# EAGLE design Antenna Analyzer R1 (EAGLE 6.4)
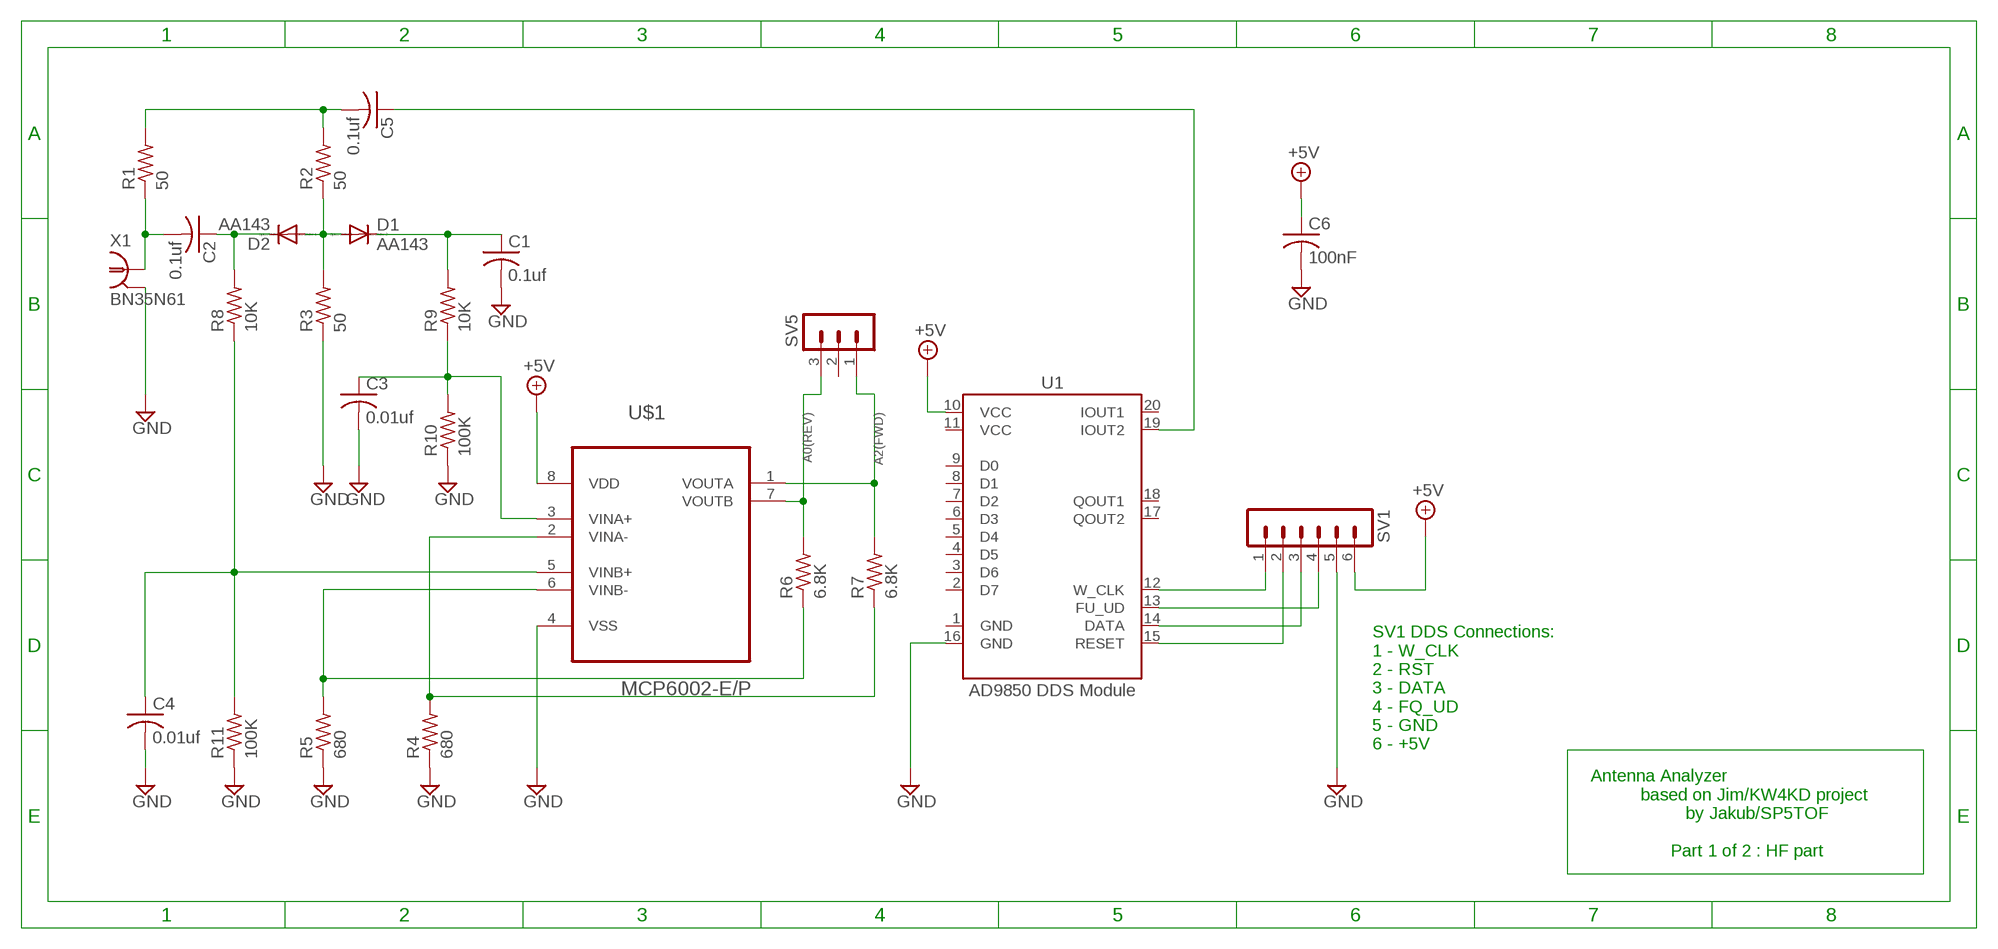
[diagram p0: schematic, sheet 1]

## Parts
C1  0.1uf  C-US050-025X075  [C050-025X075]
C2  0.1uf  C-US050-025X075  [C050-025X075]
C3  0.01uf  C-US050-025X075  [C050-025X075]
C4  0.01uf  C-US050-025X075  [C050-025X075]
C5  0.1uf  C-US050-025X075  [C050-025X075]
C6  100nF  C-US050-025X075  [C050-025X075]
D1  AA143  AA119  [DO07]
D2  AA143  AA119  [DO07]
R1  50  R-US_0309/12  [0309/12]
R2  50  R-US_0309/12  [0309/12]
R3  50  R-US_0309/12  [0309/12]
R4  680  R-US_0309/12  [0309/12]
R5  680  R-US_0309/12  [0309/12]
R6  6.8K  R-US_0309/12  [0309/12]
R7  6.8K  R-US_0309/12  [0309/12]
R8  10K  R-US_0309/12  [0309/12]
R9  10K  R-US_0309/12  [0309/12]
R10  100K  R-US_0309/12  [0309/12]
R11  100K  R-US_0309/12  [0309/12]
SV1  MA06-1  [MA06-1]
SV5  MA03-1  [MA03-1]
U1  AD9850 DDS Module  DDS_MODULE:AD9850DDS_MODULE  [DDS_AD9850]
U$1  MCP6002-E/P  [DIP254P762X533-8]
X1  BN35N61  [B35N61]

## Nets
+5V: C6.1 SV1.6 U1.10(VCC) U$1.8(VDD)
A0(REV): R6.2 SV5.3 U$1.7(VOUTB)
A2(FWD): R7.2 SV5.1 U$1.1(VOUTA)
GND: C1.2 C3.2 C4.2 C6.2 R3.1 R4.1 R5.1 R10.1 R11.1 SV1.5 U1.16(GND) U$1.4(VSS) X1.2 X1.3 X1.4 X1.5
N$1: D1.A D2.A R2.1 R3.2
N$2: C2.2 R1.1 X1.1
N$3: C2.1 D2.C R8.2
N$4: C1.1 D1.C R9.2
N$5: C3.1 R9.1 R10.2 U$1.3(VINA+)
N$6: C5.2 R1.2 R2.2
N$7: SV1.1 U1.12(W_CLK)
N$8: SV1.2 U1.15(RESET)
N$9: R5.2 R6.1 U$1.6(VINB-)
N$10: C4.1 R8.1 R11.2 U$1.5(VINB+)
N$11: R4.2 R7.1 U$1.2(VINA-)
N$12: C5.1 U1.19(IOUT2)
N$13: SV1.3 U1.14(DATA)
N$14: SV1.4 U1.13(FU_UD)
Unconnected: SV5.2 U1.2(D7) U1.3(D6) U1.4(D5) U1.5(D4) U1.6(D3) U1.7(D2) U1.8(D1) U1.9(D0) U1.17(QOUT2) U1.18(QOUT1) U1.20(IOUT1)

## Notes on the sheet
- SV1 DDS Connections:
  1 - W_CLK
  2 - RST
  3 - DATA
  4 - FQ_UD
  5 - GND
  6 - +5V
- Antenna Analyzer
             based on Jim/KW4KD project
                      by Jakub/SP5TOF
                  
                   Part 1 of 2 : HF part

## Power pins joined to a net without a drawn wire
GND: U1.1(GND)
VCC: U1.11(VCC)

## Library data of the parts
C1-C6 = rcl:C-US: CAPACITOR, American symbol
D1 D2 = diode:AA119: DIODE germanium
R1-R11 = rcl:R-US_: RESISTOR, American symbol
SV1 = con-lstb:MA06-1: PIN HEADER; OC_FARNELL: unknown; OC_NEWARK: unknown
SV5 = con-lstb:MA03-1: PIN HEADER; OC_FARNELL: unknown; OC_NEWARK: unknown
U1 = dds-module-ad9850:DDS_MODULE:AD9850: AD9850 DDS Module Created by Johan Adler, October 2014. Not tested on an actual PCB, so I can't promise anything. Also please check the actual pinout of your specific module. Mine are of the low price eBay version, and the pinout is correct for my modules. The placement of VCC over data pins over GND on the symbol is meant to make it easier to set it up for default serial transfer. For this you would connect D0 and D1 to VCC, D2 to GND. IOUT is analog signal out, sinus wave, QOUT is square wave. Outputs 1 are normal, outputs 2 are inverted.
U$1 = Microchip_By_element14_Batch_1:MCP6002-E/P: Low-Power Op Amp; MPN: MCP6002-E/P; OC_FARNELL: 1332117; OC_NEWARK: 34M7472; PACKAGE: DIP-8; SUPPLIER: Microchip
X1 = con-coax:BN35N61: BNC CONNECTOR M/A COM www.macom.com distributor Farnell 149-452; OC_FARNELL: unknown; OC_NEWARK: unknown

## Board
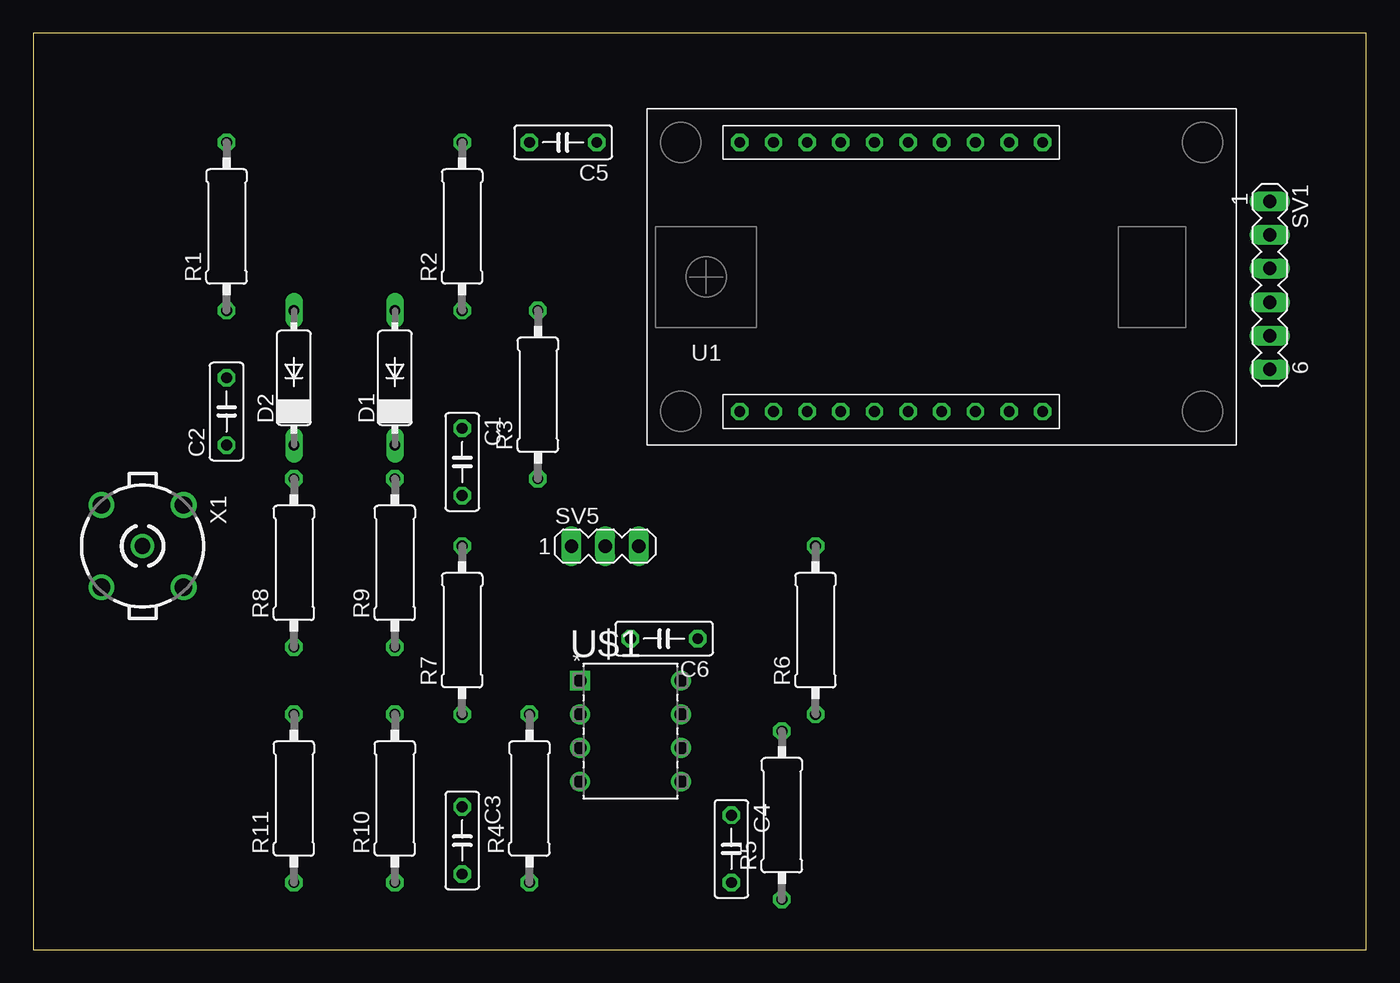
[diagram p1: board, top side]
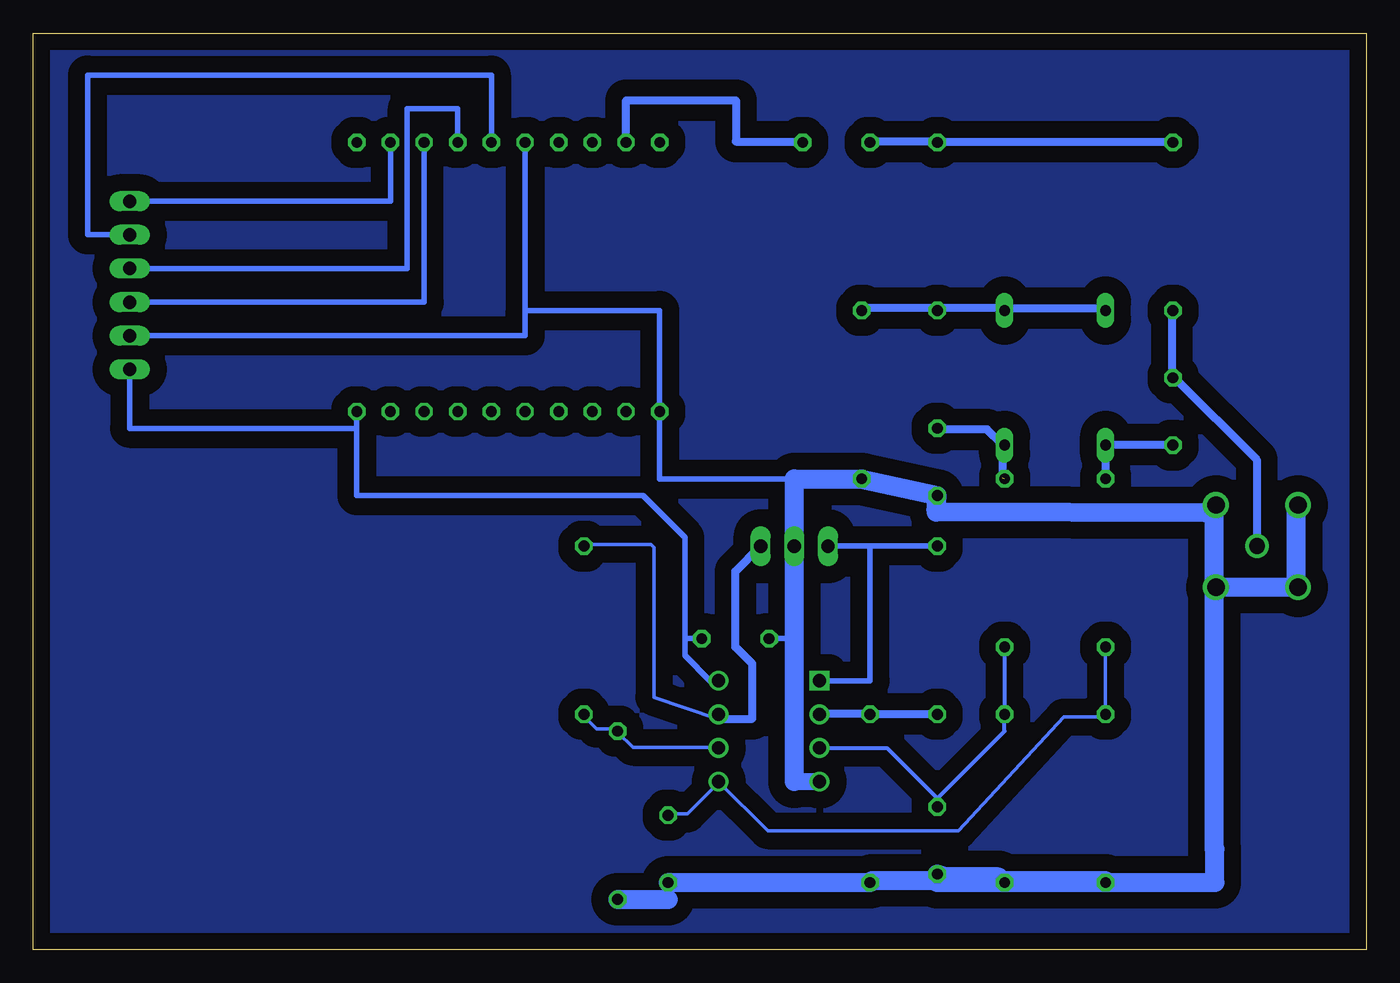
[diagram p2: board, bottom side, seen from below]

Size 100.63 x 69.2 mm. Coordinates in mm from the lower left corner, seen from the top.
Outline: 0,0 100.63,0 100.63,69.2 0,69.2 0,0
Copper layers (1*16): Top 0.035mm / dielectric 1.5mm / Bottom 0.035mm
Design rules "default": minimum track width 10mil, minimum drill 24mil, track to track 8mil, track to pad 8mil, pad to pad 8mil, via to via 8mil, smd to smd 8mil, copper to edge 40mil, drill to drill 8mil, minimum pad ring 10mil, minimum via ring 8mil, stop-mask expansion 4mil, vias tented up to drill 0mil, thermal gap 10mil

### Footprints (pad centres in the part's own frame; a part is rotated, then mirrored left to right if it is on the bottom)
C050-025X075 = drill 0.813 octagon: 1 -2.54,0; 2 2.54,0
DO07 = drill 0.813 long: A 5.08,0; C -5.08,0
0309/12 = drill 0.813 octagon: 1 -6.35,0; 2 6.35,0
MA06-1 = drill 1.016 long: 1 -6.35,0; 2 -3.81,0; 3 -1.27,0; 4 1.27,0; 5 3.81,0; 6 6.35,0
MA03-1 = drill 1.016 long: 1 -2.54,0; 2 0,0; 3 2.54,0
DDS_AD9850 = drill 0.8 octagon: 1 -15.24,-10.16; 2 -12.7,-10.16; 3 -10.16,-10.16; 4 -7.62,-10.16; 5 -5.08,-10.16; 6 -2.54,-10.16; 7 0,-10.16; 8 2.54,-10.16; 9 5.08,-10.16; 10 7.62,-10.16; 11 7.62,10.16; 12 5.08,10.16; 13 2.54,10.16; 14 0,10.16; 15 -2.54,10.16; 16 -5.08,10.16; 17 -7.62,10.16; 18 -10.16,10.16; 19 -12.7,10.16; 20 -15.24,10.16
DIP254P762X533-8 = drill 0.991 square: 1 -7.62,7.62 | drill 0.991: 2 -7.62,5.08; 3 -7.62,2.54; 4 -7.62,0; 5 0,0; 6 0,2.54; 7 0,5.08; 8 0,7.62
B35N61 = drill 1.2: 1 0,0 | drill 1.3: 2 3.099,3.099; 3 -3.099,3.099; 4 -3.099,-3.099; 5 3.099,-3.099

### Placement (x,y rotation side)
C1  32.39,36.83 270 top
C2  14.61,40.64 90 top
C3  32.39,8.26 270 top
C4  52.71,7.62 270 top
C5  40.01,60.96 180 top
C6  47.62,23.5 180 top
D1  27.3,43.18 90 top
D2  19.68,43.18 90 top
R1  14.61,54.61 90 top
R2  32.39,54.61 90 top
R3  38.1,41.91 90 top
R4  37.47,11.43 90 top
R5  56.52,10.16 90 top
R6  59.05,24.13 90 top
R7  32.39,24.13 90 top
R8  19.68,29.21 90 top
R9  27.3,29.21 90 top
R10  27.3,11.43 90 top
R11  19.68,11.43 90 top
SV1  93.34,50.17 270 top
SV5  43.18,30.48 0 top
U1  68.58,50.8 0 top
U$1  48.9,12.7 0 top
X1  8.26,30.48 270 top

### Tracks (layer width: path | path; a pad name or v marks a point on that pad's centre or on a via)
+5V
  Bottom 0.406: SV1.6 93.34,39.37 76.2,39.37 | 76.2,39.37 U1.10 | 76.2,39.37 76.2,34.29 54.61,34.29 51.44,31.12 51.44,23.5 | U$1.8 49.53,20.32 51.44,22.23 51.44,23.5 | C6.1 51.44,23.5
A0(REV)
  Bottom 0.254: R6.2 59.03,30.61 54,30.61 53.77,30.38 53.77,19.08 48.97,17.45
  Bottom 0.406: 48.97,17.8 U$1.7
  Bottom 0.61: 48.97,17.8 48.97,17.45 46.36,17.45 46.36,21.59 47.62,22.86 47.62,28.58 SV5.3
A2(FWD)
  Bottom 0.406: U$1.1 37.47,20.32 37.47,30.48 | 37.47,30.48 SV5.1 | R7.2 37.47,30.48
GND
  Bottom 0.254: 11.25,27.41 X1.2 11.48,27.41 11.48,27.94 | 5.31,33.58 X1.4 | 5.31,27.41 X1.5 | 12.17,33 11.48,33.58 X1.3 | R4.1 37.31,5.23 33.43,5.23 32.51,6.15 C3.2 | 19.71,5.23 R11.1 | 27.25,5.23 R10.1 27.48,5.23
  Bottom 0.406: 52.71,3.81 C4.2 | 32.39,5.23 32.39,5.08 | 11.43,7.62 11.48,7.62 | C6.2 43.18,23.5 | U1.16 63.5,48.26 | 63.5,48.26 53.34,48.26 U1.1 53.34,35.56 43.18,35.56 | SV1.5 63.5,46.36 63.5,48.26
  Bottom 1.27: U$1.4 43.18,12.7
  Bottom 1.422: 11.25,27.41 5.31,27.41 5.31,33.58 | 11.48,33.58 11.48,27.94 11.48,7.62 | 12.17,33 32.49,33.05 C1.2 R3.1 43.18,35.56 43.18,23.5 43.18,12.7 | 27.25,5.23 19.71,5.23 | 27.48,5.23 27.76,5.51 31.65,5.51 C3.2 | R5.1 52.71,3.81 | C4.2 R4.1 | 37.31,5.23 32.39,5.23 | 32.39,5.08 R11.1 11.43,5.08 11.43,7.62
N$1
  Bottom 0.254: 19.71,48.44 D2.A | 27.25,48.44 D1.A 27.48,48.44 | 32.28,48.44 R2.1 32.51,48.44
  Bottom 0.406: 38.1,48.44 R3.2
  Bottom 0.61: 27.25,48.44 19.71,48.44 | 27.48,48.44 32.28,48.44 | 32.51,48.44 38.1,48.44
N$2
  Bottom 0.254: 14.68,43.18 C2.2 14.45,43.18 | 14.68,48.21 R1.1 | 8.28,30.61 X1.1
  Bottom 0.61: 14.68,48.21 14.68,43.18 | 8.28,30.61 8.28,37.01 14.45,43.18
N$3
  Bottom 0.254: 19.71,35.64 R8.2 | 19.71,37.92 D2.C 19.48,38.15 | 14.68,38.15 C2.1
  Bottom 0.61: 19.71,37.92 19.71,35.64 | 19.48,38.15 14.68,38.15
N$4  (1 unrouted)
  Bottom 0.254: 27.48,37.92 D1.C 27.48,38.15 | 32.28,39.29 C1.1
  Bottom 0.61: 27.48,37.92 27.48,35.64 | 32.28,39.29 28.63,39.29 27.48,38.15
N$5
  Bottom 0.305: R9.1 R10.2 27.3,16.51 32.39,11.43 | C3.1 32.39,11.43 | U$1.3 36.2,15.24 32.39,11.43
N$6
  Bottom 0.254: 14.68,61.01 R1.2 | 32.28,61.01 R2.2 32.51,61.01 | 37.31,61.01 C5.2
  Bottom 0.61: 32.28,61.01 14.68,61.01 | 32.51,61.01 37.31,61.01
N$7
  Bottom 0.406: SV1.1 73.66,56.52 U1.12
N$8
  Bottom 0.406: SV1.2 96.52,53.97 96.52,66.04 66.04,66.04 U1.15
N$9
  Bottom 0.254: R6.1 59.03,17.58 58.12,16.66 56.52,16.66 R5.2 56.52,16.43 55.37,15.29 48.97,15.29 U$1.6
N$10
  Bottom 0.254: R8.1 19.71,22.84 19.71,17.8 R11.2 19.71,17.58 22.83,17.58 30.79,8.99 45.19,8.99 U$1.5 48.97,12.55 51.26,10.26 52.63,10.26 C4.1
N$11
  Bottom 0.254: 32.51,17.8 R7.1 | 37.31,17.8 R4.2 37.54,17.8 | 41.2,17.8 U$1.2
  Bottom 0.61: 37.31,17.8 32.51,17.8 | 37.54,17.8 41.2,17.8
N$12
  Bottom 0.254: 42.57,61.01 C5.1
  Bottom 0.61: 42.57,61.01 47.6,61.01 47.6,64.14 55.88,64.14 U1.19
N$13
  Bottom 0.406: SV1.3 72.39,51.44 72.39,63.5 68.58,63.5 U1.14
N$14
  Bottom 0.406: SV1.4 71.12,48.9 U1.13
N$15
  pour Bottom (isolate 1.27): 100.96,0 0,0 0,69.22 100.96,69.22